# EAGLE design PCB (EAGLE 8.1.1)
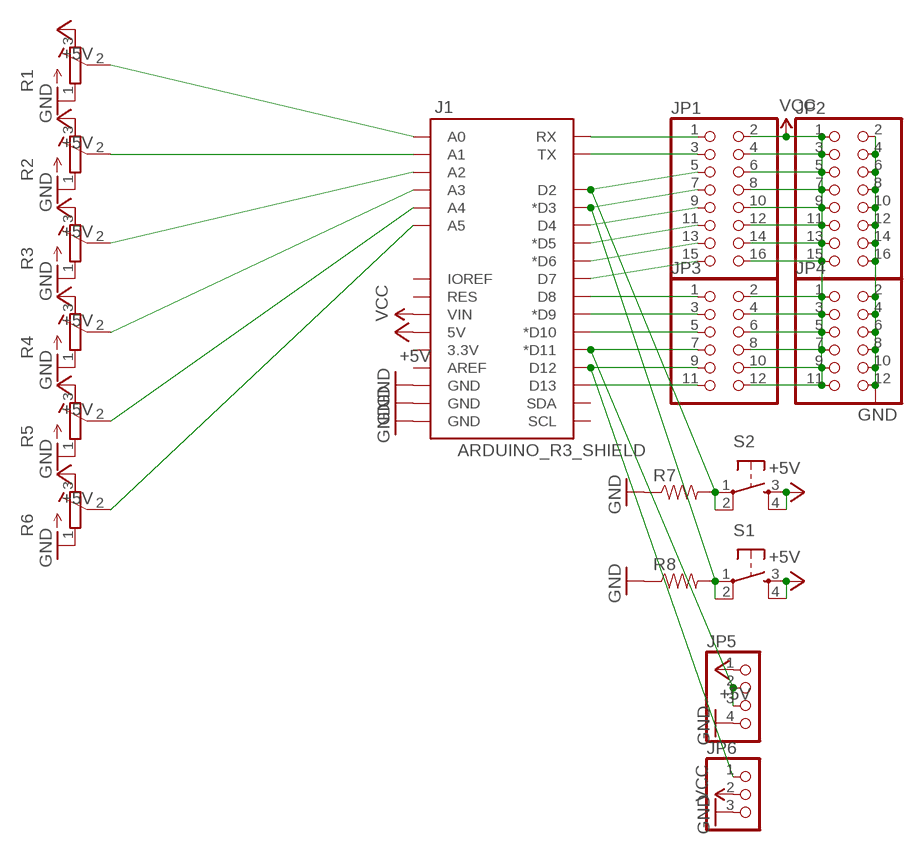
[diagram p0: schematic, sheet 1]

## Parts
J1  ARDUINO_R3_SHIELD  [UNO_R3_SHIELD]
JP1  PINHD-2X8  [2X08]
JP2  PINHD-2X8  [2X08]
JP3  PINHD-2X6  [2X06]
JP4  PINHD-2X6  [2X06]
JP5  PINHD-1X4  [1X04]
JP6  PINHD-1X3  [1X03]
R1  R-TRIMM3339P  [RTRIM3339P]
R2  R-TRIMM3339P  [RTRIM3339P]
R3  R-TRIMM3339P  [RTRIM3339P]
R4  R-TRIMM3339P  [RTRIM3339P]
R5  R-TRIMM3339P  [RTRIM3339P]
R6  R-TRIMM3339P  [RTRIM3339P]
R7  RESISTOREZ  [AXIAL-0.3EZ]
R8  RESISTOREZ  [AXIAL-0.3EZ]
S1  TAC_SWITCHPTH  [TACTILE-PTH]
S2  TAC_SWITCHPTH  [TACTILE-PTH]

## Nets
+5V: J1.5V JP5.1 R1.3(E) R2.3(E) R3.3(E) R4.3(E) R5.3(E) R6.3(E) S1.3 S1.4 S2.3 S2.4
GND: J1.GND@0(GND) J1.GND@1(GND) J1.GND@2(GND) JP2.2 JP2.4 JP2.6 JP2.8 JP2.10 JP2.12 JP2.14 JP2.16 JP4.2 JP4.4 JP4.6 JP4.8 JP4.10 JP4.12 JP5.4 JP6.3 R1.1(A) R2.1(A) R3.1(A) R4.1(A) R5.1(A) R6.1(A) R7.P$1 R8.P$1
N$1: J1.A5 R6.2(S)
N$2: J1.A4 R5.2(S)
N$3: J1.A3 R4.2(S)
N$4: J1.A2 R3.2(S)
N$5: J1.A1 R2.2(S)
N$6: J1.A0 R1.2(S)
N$7: J1.RX JP1.1
N$8: J1.D2 JP1.5 R7.P$2 S2.1 S2.2
N$9: J1.D3(*D3) JP1.7 R8.P$2 S1.1 S1.2
N$10: J1.D4 JP1.9
N$11: J1.D5(*D5) JP1.11
N$12: J1.D6(*D6) JP1.13
N$13: J1.D7 JP1.15
N$14: J1.TX JP1.3
N$15: J1.D11(*D11) JP3.7 JP5.2 JP5.3
N$23: J1.D8 JP3.1
N$24: J1.D9(*D9) JP3.3
N$25: J1.D10(*D10) JP3.5
N$27: J1.D12 JP3.9 JP6.1
N$28: J1.D13 JP3.11
VCC: J1.VIN JP1.2 JP1.4 JP1.6 JP1.8 JP1.10 JP1.12 JP1.14 JP1.16 JP2.1 JP2.3 JP2.5 JP2.7 JP2.9 JP2.11 JP2.13 JP2.15 JP3.2 JP3.4 JP3.6 JP3.8 JP3.10 JP3.12 JP4.1 JP4.3 JP4.5 JP4.7 JP4.9 JP4.11 JP6.2
Unconnected: J1.3.3V J1.AREF J1.IOREF J1.RES J1.SCL J1.SDA

## Library data of the parts
J1 = SparkFun-Boards:ARDUINO_R3_SHIELD: Shield form compatible with the Arduino Uno R3.
JP1 JP2 = pinhead:PINHD-2X8: PIN HEADER
JP3 JP4 = pinhead:PINHD-2X6: PIN HEADER
JP5 = pinhead:PINHD-1X4: PIN HEADER
JP6 = pinhead:PINHD-1X3: PIN HEADER
R1-R6 = rcl:R-TRIMM: Trimm resistor
R7 R8 = SparkFun-Resistors:RESISTOR: Resistor Basic schematic elements and footprints for 0603, 1206, and PTH resistors.
S1 S2 = SparkFun-Retired:TAC_SWITCH: Momentary Switch Button commonly used for reset or general input. Spark Fun Electronics SKU : COM-00097 SMT- SWCH-08247

## Board
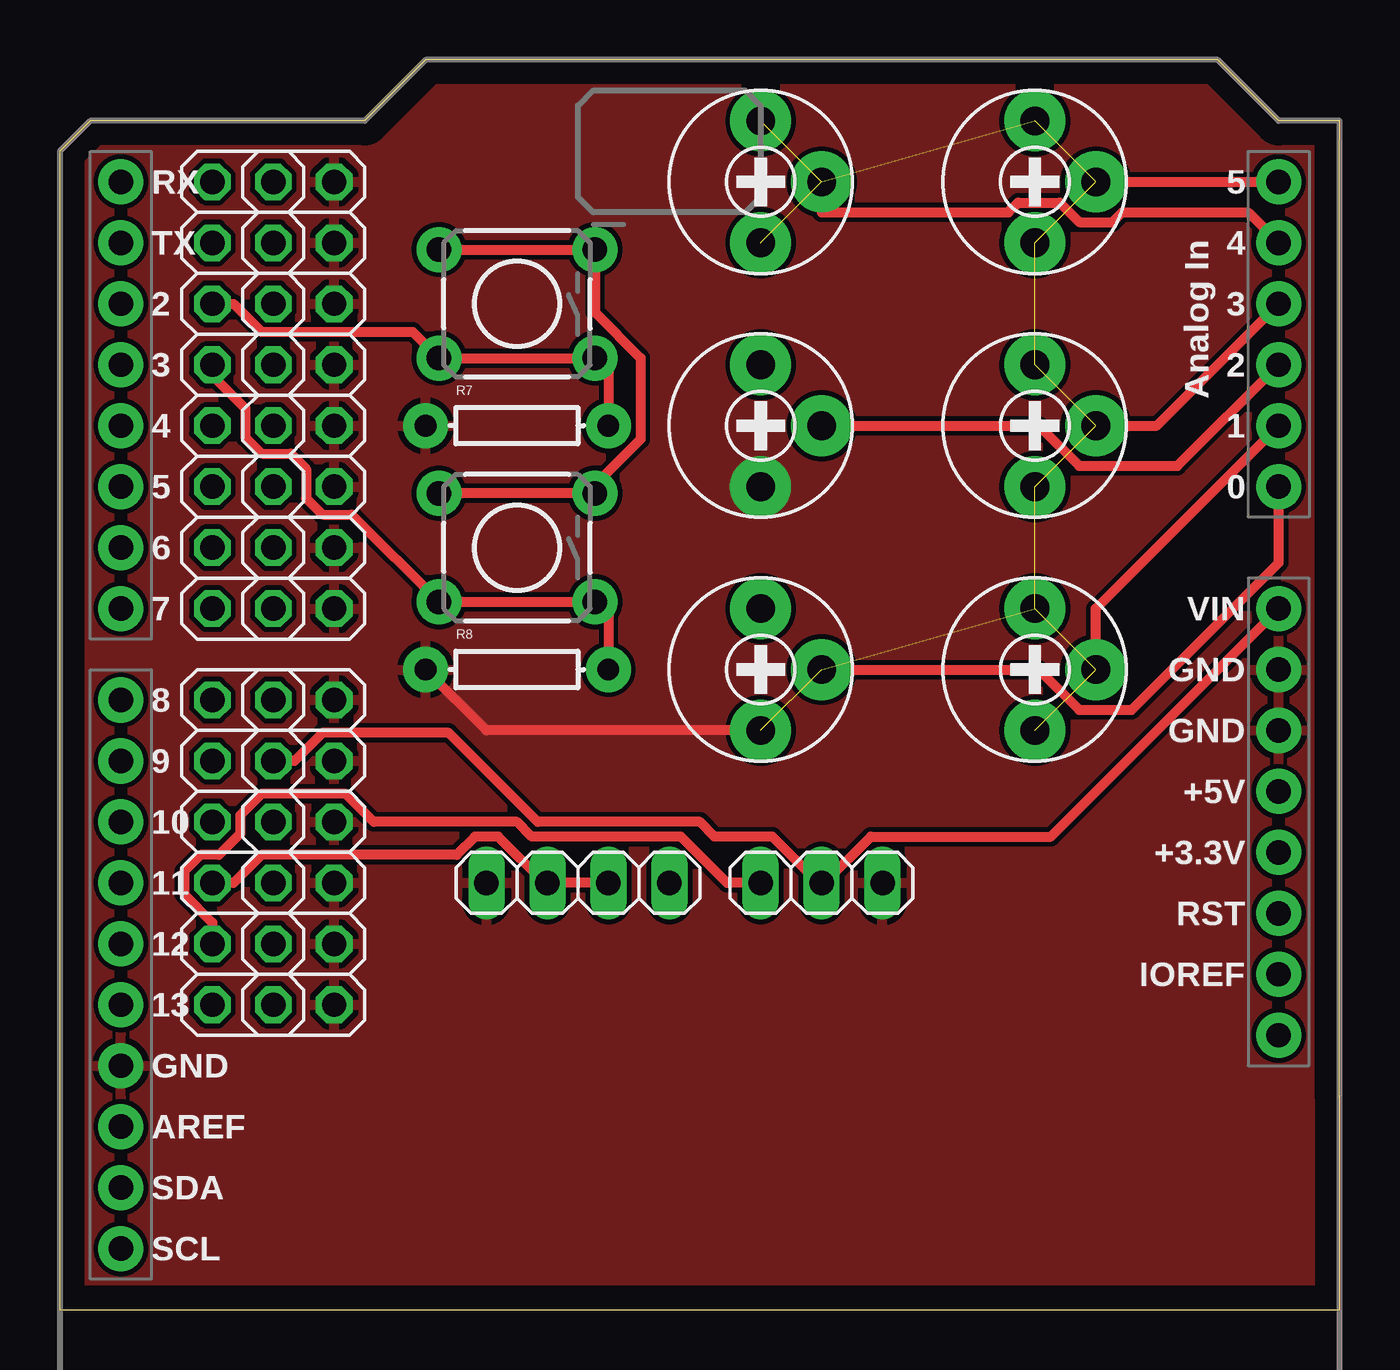
[diagram p1: board, top side]
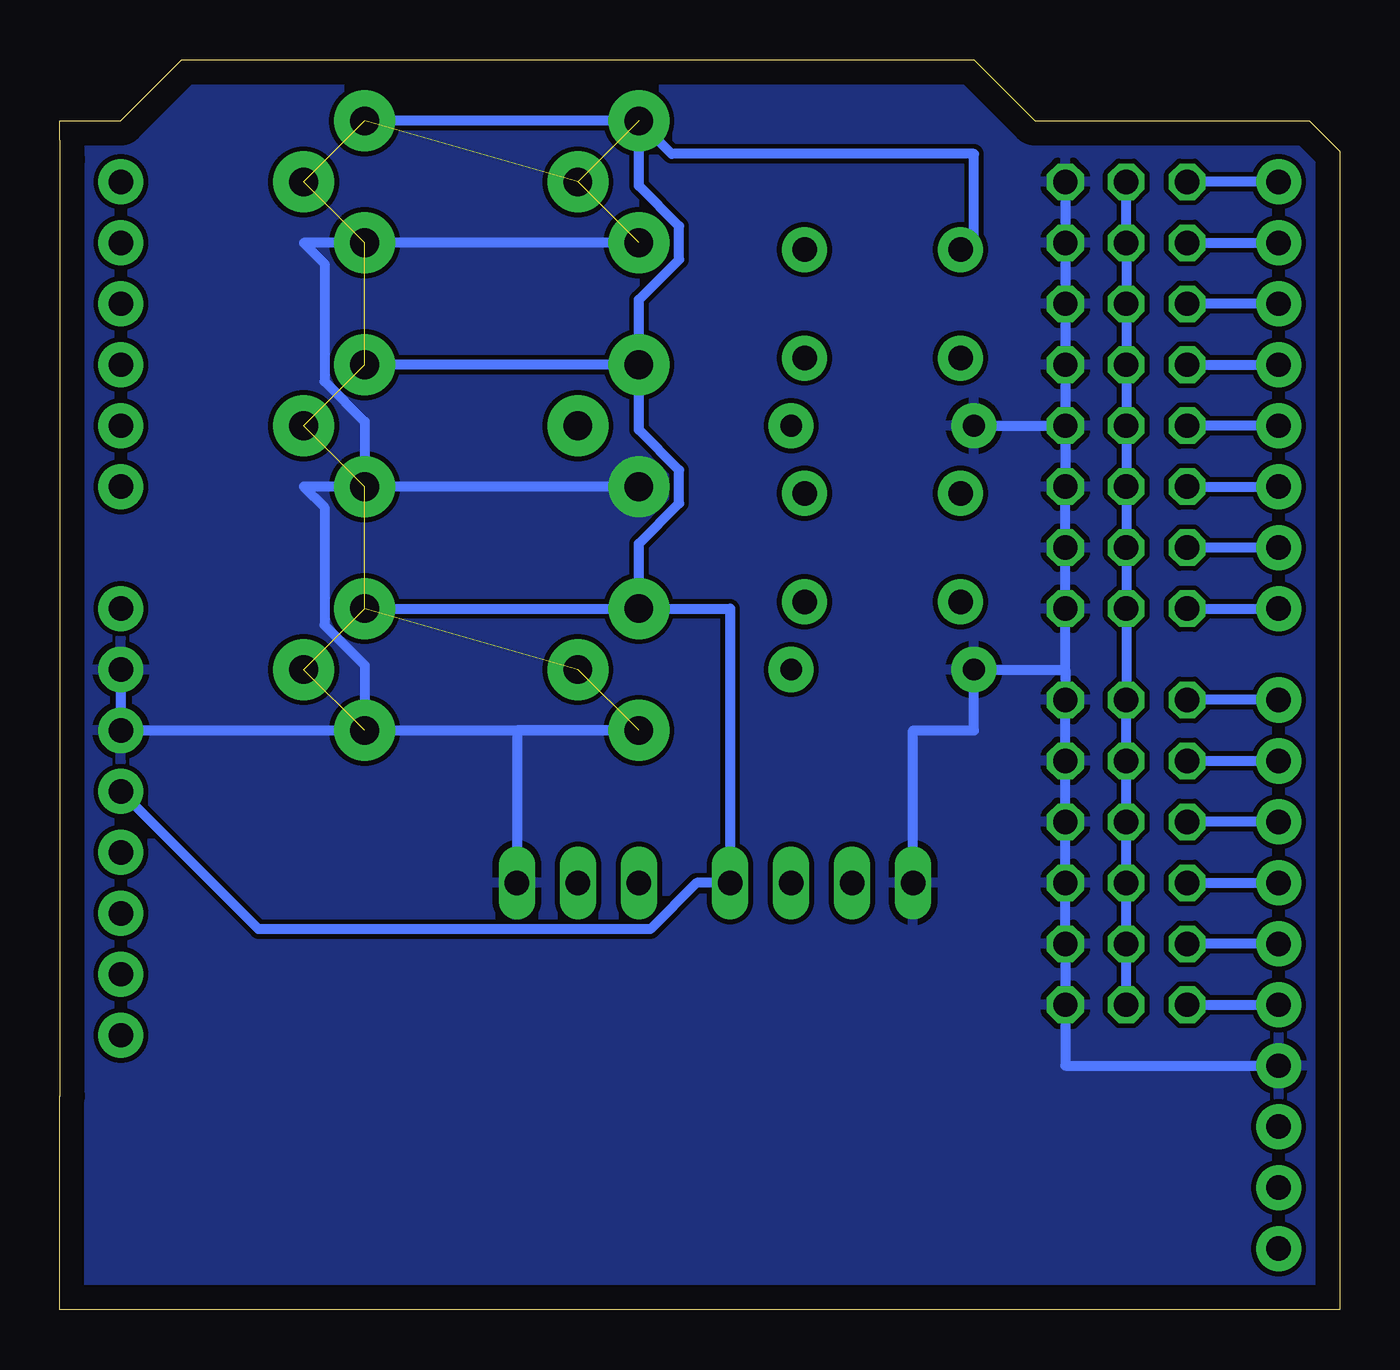
[diagram p2: board, bottom side, seen from below]

Size 53.34 x 52.07 mm. Coordinates in mm from the lower left corner, seen from the top.
Outline: 0,0 53.34,0 53.34,8.89 53.32,8.89 53.32,47.93 53.34,49.53 50.8,49.53 48.26,52.07 15.24,52.07 12.7,49.53 1.27,49.53 0,48.26 0,0
Copper layers (1*16): Top 0.035mm / dielectric 1.5mm / Bottom 0.035mm
Design rules "default": minimum track width 10mil, minimum drill 24mil, track to track 8mil, track to pad 8mil, pad to pad 8mil, via to via 8mil, smd to smd 8mil, copper to edge 40mil, drill to drill 8mil, minimum pad ring 10mil, minimum via ring 8mil, stop-mask expansion 4mil, vias tented up to drill 0mil, thermal gap 10mil

### Footprints (pad centres in the part's own frame; a part is rotated, then mirrored left to right if it is on the bottom)
UNO_R3_SHIELD = drill 1.016 pad 1.88: 3.3V 50.8,26.67; 5V 50.8,29.21; A0 50.8,41.91; A1 50.8,44.45; A2 50.8,46.99; A3 50.8,49.53; A4 50.8,52.07; A5 50.8,54.61; AREF 2.54,15.24; D2 2.54,49.53; D3 2.54,46.99; D4 2.54,44.45; D5 2.54,41.91; D6 2.54,39.37; D7 2.54,36.83; D8 2.54,33.02; D9 2.54,30.48; D10 2.54,27.94; D11 2.54,25.4; D12 2.54,22.86; D13 2.54,20.32; GND@0 50.8,31.75; GND@1 50.8,34.29; GND@2 2.54,17.78; IOREF 50.8,21.59; NC 50.8,19.05; RES 50.8,24.13; RX 2.54,54.61; SCL 2.54,10.16; SDA 2.54,12.7; TX 2.54,52.07; VIN 50.8,36.83
2X08 = drill 1.016 octagon: 1 -8.89,-1.27; 2 -8.89,1.27; 3 -6.35,-1.27; 4 -6.35,1.27; 5 -3.81,-1.27; 6 -3.81,1.27; 7 -1.27,-1.27; 8 -1.27,1.27; 9 1.27,-1.27; 10 1.27,1.27; 11 3.81,-1.27; 12 3.81,1.27; 13 6.35,-1.27; 14 6.35,1.27; 15 8.89,-1.27; 16 8.89,1.27
2X06 = drill 1.016 octagon: 1 -6.35,-1.27; 2 -6.35,1.27; 3 -3.81,-1.27; 4 -3.81,1.27; 5 -1.27,-1.27; 6 -1.27,1.27; 7 1.27,-1.27; 8 1.27,1.27; 9 3.81,-1.27; 10 3.81,1.27; 11 6.35,-1.27; 12 6.35,1.27
1X04 = drill 1.016 long: 1 -3.81,0; 2 -1.27,0; 3 1.27,0; 4 3.81,0
1X03 = drill 1.016 long: 1 -2.54,0; 2 0,0; 3 2.54,0
RTRIM3339P = drill 0.61: 1 -2.54,0; 2 0,-2.54; 3 2.54,0
AXIAL-0.3EZ = drill 0.9 pad 1.88: P$1 -3.81,0; P$2 3.81,0
TACTILE-PTH = drill 1.016 pad 1.88: 1 -3.251,2.261; 2 3.251,2.261; 3 -3.251,-2.261; 4 3.251,-2.261

### Placement (x,y rotation side)
J1  0,-7.62 0 top
JP1  7.62,38.1 270 top
JP2  10.16,38.1 270 top
JP3  7.62,19.05 270 top
JP4  10.16,19.05 270 top
JP5  21.59,17.78 180 top
JP6  31.75,17.78 0 top
R1  29.21,26.67 90 top
R2  40.64,26.67 90 top
R3  29.21,36.83 90 top
R4  40.64,36.83 90 top
R5  29.21,46.99 90 top
R6  40.64,46.99 90 top
R7  19.05,36.83 0 top
R8  19.05,26.67 0 top
S1  19.05,31.75 180 top
S2  19.05,41.91 180 top

### Tracks (layer width: path | path; a pad name or v marks a point on that pad's centre or on a via)
+5V  (via drill 1.2 pad 2.54)
  Top 0.406: S1.4 S1.3 22.3,34.37 24.21,36.27 24.21,39.65 22.3,41.55 S2.3 S2.4 15.52,44.17 15.24,44.45
  Bottom 0.406: R5.3 R6.3 | R3.3 R4.3 | R5.3 27.84,48.16 15.24,48.16 15.24,44.17 S2.4 | R2.3 R1.3 | R3.3 29.21,42.08 27.53,43.76 27.53,45.14 29.21,46.82 R5.3 | R1.3 29.21,31.92 27.53,33.6 27.53,34.98 29.21,36.66 R3.3 | R1.3 25.4,29.21 JP5.1 26.8,17.78 28.73,15.85 45.06,15.85 J1.5V
  other vias: 29.21,39.37 29.21,29.21
GND  (via drill 1.2 pad 2.54)
  Top 0.406: R8.P$1 17.78,24.13 R1.1
  Bottom 0.406: 11.43,26.67 JP4.2 JP4.4 JP4.6 JP4.8 JP4.10 JP4.12 11.43,10.16 J1.GND@2 | 11.43,26.67 JP2.16 JP2.14 JP2.12 JP2.10 | JP2.2 JP2.4 JP2.6 JP2.8 JP2.10 | R5.1 R6.1 43.18,44.45 42.32,43.59 42.32,38.68 40.64,37 R4.1 | R3.1 R4.1 | R2.1 R1.1 34.29,24.13 JP6.3 | R2.1 J1.GND@0 J1.GND@1 | 11.43,26.67 R8.P$1 15.24,24.13 17.78,24.13 JP5.4 | R7.P$1 JP2.10 | R4.1 43.18,34.29 42.32,33.43 42.32,28.52 40.64,26.84 R2.1
  other vias: 29.21,34.29
  pour Bottom: 1.27,49.53 0,48.26 0,0 53.34,0 53.34,49.53 50.8,49.53 48.26,52.07 15.24,52.07 12.7,49.53
  pour Top: 0,0 53.34,0 53.34,49.53 50.8,49.53 48.26,52.07 15.24,52.07 12.7,49.53 1.27,49.53 0,48.26
N$1
  Top 0.406: R6.2 J1.A5
N$2
  Top 0.406: J1.A4 49.53,45.72 44.28,45.72 43.87,45.31 42.49,45.31 41.67,46.13 39.95,46.13 39.54,45.72 31.75,45.72 R5.2
N$3
  Top 0.406: R4.2 45.72,36.83 J1.A3
N$4  (via drill 1.2 pad 2.54)
  Top 0.406: R3.2 40.81,36.83 42.49,35.15 46.58,35.15 J1.A2
  other vias: 31.75,36.83
N$5
  Top 0.406: R2.2 43.18,29.21 J1.A1
N$6
  Top 0.406: J1.A0 50.8,31.11 44.68,24.99 42.49,24.99 40.81,26.67 R1.2
N$7
  Bottom 0.406: J1.RX JP1.1
N$8
  Top 0.406: JP1.5 7.24,41.91 8.41,40.74 14.71,40.74 S2.2 S2.1 22.86,39.65 R7.P$2
  Bottom 0.406: J1.D2 JP1.5
N$9
  Top 0.406: JP1.7 6.35,38.94 7.72,37.57 7.72,36.35 8.41,35.66 9.63,35.66 10.26,35.03 10.26,33.81 10.95,33.12 12.17,33.12 S1.2 S1.1 22.86,29.49 R8.P$2
  Bottom 0.406: JP1.7 J1.D3
N$10
  Bottom 0.406: J1.D4 JP1.9
N$11
  Bottom 0.406: JP1.11 J1.D5
N$12
  Bottom 0.406: J1.D6 JP1.13
N$13
  Bottom 0.406: JP1.15 J1.D7
N$14
  Bottom 0.406: JP1.3 J1.TX
N$15
  Top 0.406: JP5.2 JP5.3 20.19,17.78 18.26,19.71 17.3,19.71 16.53,18.95 8.41,18.95 7.24,17.78 JP3.7
  Bottom 0.406: JP3.7 J1.D11
N$16  (via drill 1.2 pad 2.54)  (13 unrouted)
  other vias: 29.21,49.53 31.75,46.99 29.21,44.45 40.64,49.53 43.18,46.99 40.64,44.45 40.64,39.37 43.18,36.83 40.64,34.29 40.64,29.21 43.18,26.67 40.64,24.13 31.75,26.67 29.21,24.13
N$23
  Bottom 0.406: J1.D8 JP3.1
N$24
  Bottom 0.406: JP3.3 J1.D9
N$25
  Bottom 0.406: J1.D10 JP3.5
N$27
  Top 0.406: JP6.1 27.81,17.78 25.88,19.71 19.66,19.71 19.05,20.32 13.08,20.32 11.91,21.49 8.41,21.49 7.52,20.6 7.52,19.84 6.63,18.95 5.87,18.95 5.18,18.26 5.18,17.3 6.35,16.13 JP3.9
  Bottom 0.406: J1.D12 JP3.9
N$28
  Bottom 0.406: JP3.11 J1.D13
VCC
  Top 0.406: J1.VIN 41.3,19.71 33.81,19.71 31.88,17.78 JP6.2 31.62,17.78 29.69,19.71 27.28,19.71 26.67,20.32 19.91,20.32 16.2,24.03 10.95,24.03 9.78,22.86 JP4.3
  Bottom 0.406: JP4.11 JP4.9 JP4.7 JP4.5 JP4.3 JP4.1 JP2.15 JP2.13 JP2.11 JP2.9 JP2.7 JP2.5 JP2.3 JP2.1